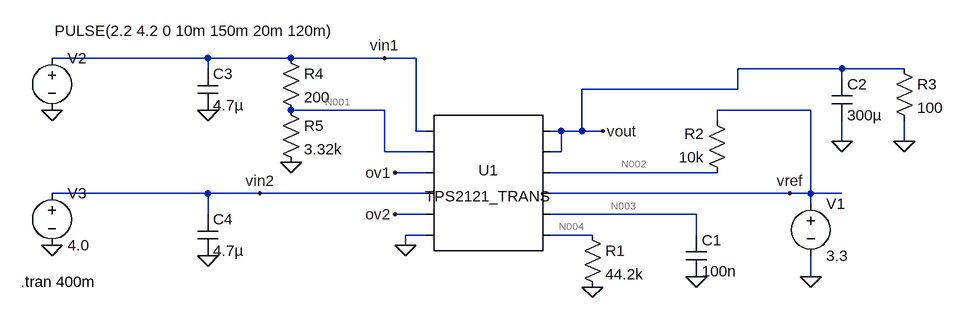
[diagram p0: schematic load-switch.asc]
* load-switch.asc
* U1: TPS2121_TRANS (symbol AutoGenerated\TPS2121_TRANS not available, pins judged from their places): pin1=vin1 pin2=N001 pin3=ov1 pin4=vin2 pin5=ov2 pin6=0 pin7=vout pin8=vout pin9=N002 pin10=vref pin11=N003 pin12=N004
R1 N004 0 44.2k
C1 N003 0 100n
R2 N002 vref 10k
C2 vout 0 300µ
R3 vout 0 100
V1 vref 0 3.3
R4 vin1 N001 200
R5 N001 0 3.32k
V2 vin1 0 PULSE(2.2 4.2 0 10m 150m 20m 120m)
V3 vin2 0 4.0
C3 vin1 0 4.7µ
C4 vin2 0 4.7µ
.tran 400m
.backanno
.end

* Results of the author's LTspice run, read from the files saved beside the schematic
* Operating Point, zero values left out:
*   V(vin2) = 4 V
*   V(vin1) = 2.2 V
*   V(vout) = 3.998 V
*   V(n001) = 2.075 V
*   V(vref) = 3.3 V
*   V(n002) = 16.5 µV
*   V(n004) = 88.4 mV
*   V(n003) = 4 V
*   I(R5) = 625 µA
*   I(R4) = 625 µA
*   I(R3) = 39.98 mA
*   I(R2) = -330 µA
*   I(R1) = 2 µA
*   I(V2) = -625 µA
*   I(V1) = -330 µA
*   Ix(u1:GND) = -328 µA
*   Ix(u1:ILIM) = -2 µA
*   Ix(u1:SS) = -1.571 pA
*   Ix(u1:ST) = 330 µA
*   Ix(u1:VOUT_0) = -39.98 mA
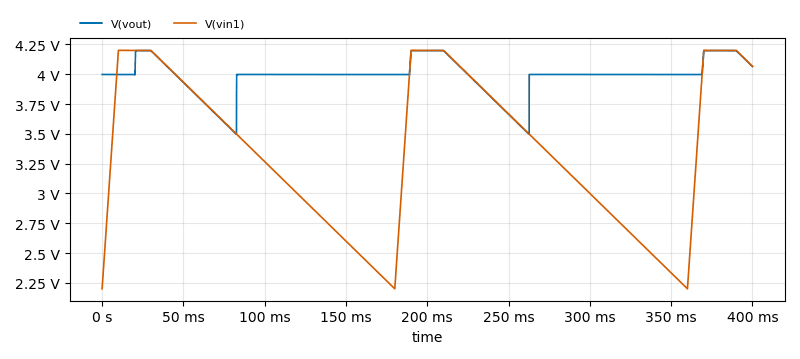
[diagram p1: Transient Analysis of load-switch.asc, plotted from the saved traces]
* Transient Analysis, 1 run:
*   V(vout): min 3.496 V, max 4.198 V, average 3.987 V, rms 3.991 V, last 4.065 V
*   V(vin1): min 2.2 V, max 4.2 V, average 3.373 V, rms 3.438 V, last 4.067 V